# Altium schematic sheet SENSOR_BANK.SchDoc
size A4; SheetNumber: 5; SheetTotal: 10
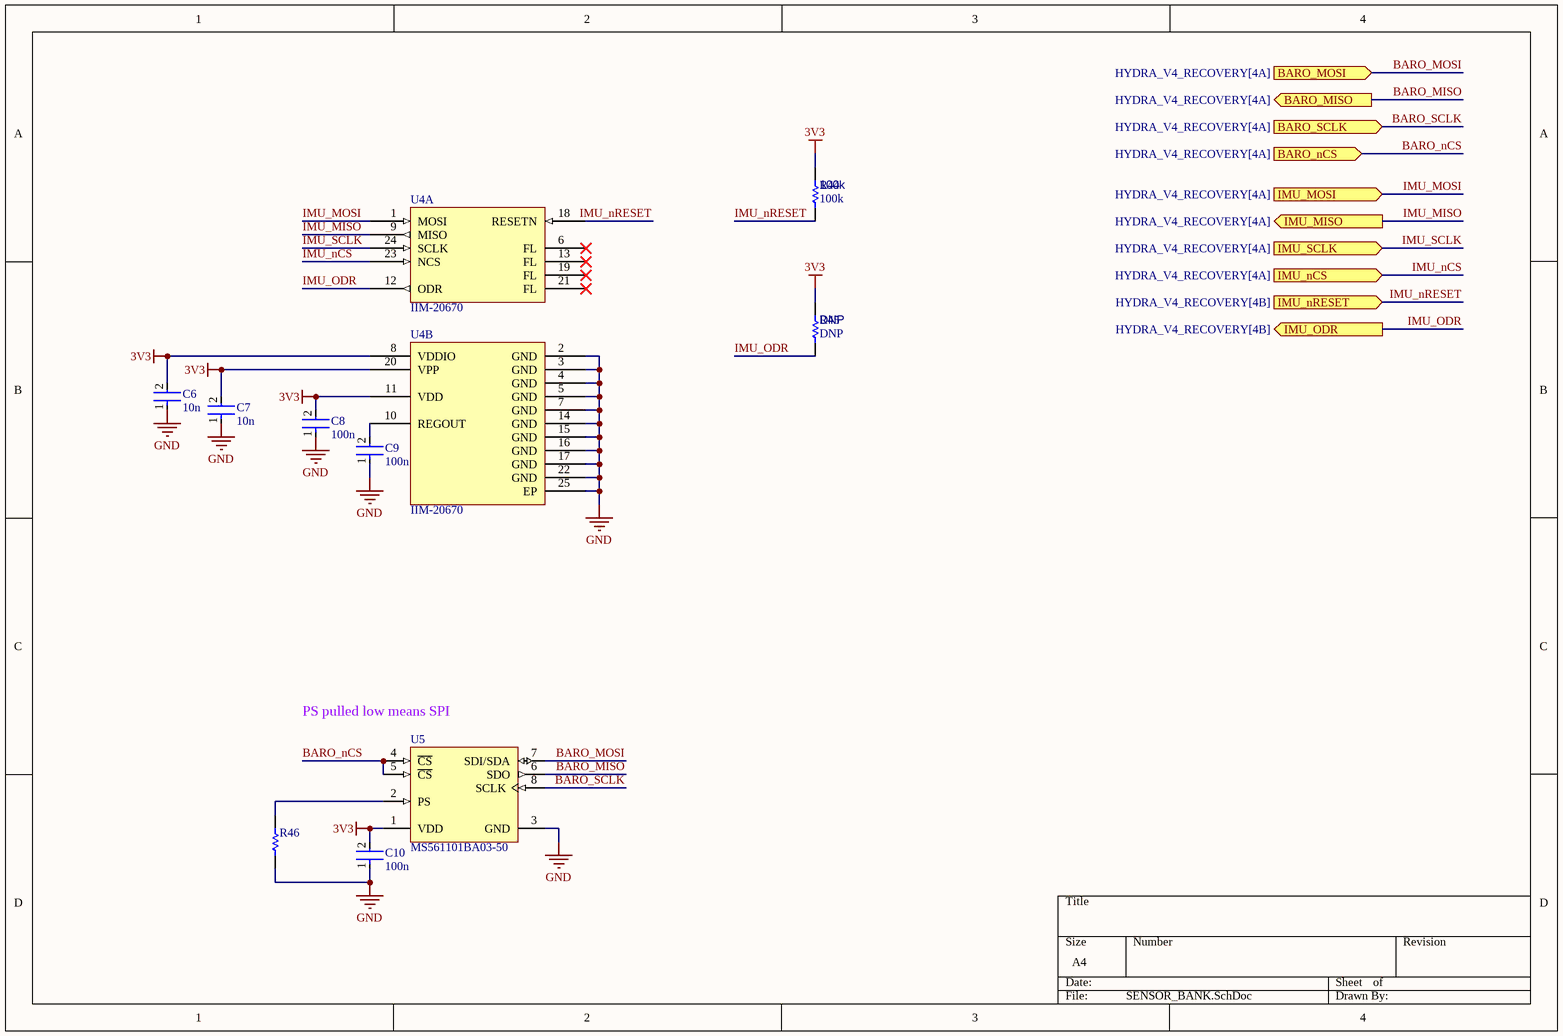
[diagram p0: SENSOR_BANK.SchDoc]

## Parts
C6  10n  [FP-0402-L_1_0_0_05-W_0_5-IPC_A]
C7  10n  [FP-0402-L_1_0_0_05-W_0_5-IPC_A]
C8  100n  [FP-0402-L_1_0_0_05-W_0_5-IPC_A]
C9  100n  [FP-0402-L_1_0_0_05-W_0_5-IPC_A]
C10  100n  [FP-0402-L_1_0_0_05-W_0_5-IPC_A]
R44  100k  [R0603B]
R45  DNP  [R0603B]
R46  0402 JUMPER  [RESC1005X40X25ML05T05]  (value not drawn)
U4  IIM-20670  [PQFN50P450X450X115_HS-25N]  (parts A,B of 2)
U5  MS561101BA03-50  [MSI-MS561101BA03-50-8_V]

## Ports
BARO_MISO (out, see HYDRA_V4_RECOVERY[4A]), BARO_MOSI (in, see HYDRA_V4_RECOVERY[4A]), BARO_nCS (in, see HYDRA_V4_RECOVERY[4A]), BARO_SCLK (in, see HYDRA_V4_RECOVERY[4A]), IMU_MISO (out, see HYDRA_V4_RECOVERY[4A]), IMU_MOSI (in, see HYDRA_V4_RECOVERY[4A]), IMU_nCS (in, see HYDRA_V4_RECOVERY[4A]), IMU_nRESET (in, see HYDRA_V4_RECOVERY[4B]), IMU_ODR (out, see HYDRA_V4_RECOVERY[4B]), IMU_SCLK (in, see HYDRA_V4_RECOVERY[4A])

## Nets
3V3: C6.2 C7.2 C8.2 C10.2 R44.2 R45.1 U4.8(VDDIO) U4.11(VDD) U4.20(VPP) U5.1(VDD)
GND: C6.1 C7.1 C8.1 C9.1 C10.1 R46.1 U4.2(GND) U4.3(GND) U4.4(GND) U4.5(GND) U4.7(GND) U4.14(GND) U4.15(GND) U4.16(GND) U4.17(GND) U4.22(GND) U4.25(EP) U5.3(GND)
BARO_MISO: U5.6(SDO) ; port BARO_MISO
BARO_MOSI: U5.7(SDI/SDA) ; port BARO_MOSI
BARO_nCS: U5.4(~{CS}) U5.5(~{CS}) ; port BARO_nCS
BARO_SCLK: U5.8(SCLK) ; port BARO_SCLK
IMU_MISO: U4.9(MISO) ; port IMU_MISO
IMU_MOSI: U4.1(MOSI) ; port IMU_MOSI
IMU_nCS: U4.23(NCS) ; port IMU_nCS
IMU_nRESET: R44.1 U4.18(RESETN) ; port IMU_nRESET
IMU_ODR: R45.2 U4.12(ODR) ; port IMU_ODR
IMU_SCLK: U4.24(SCLK) ; port IMU_SCLK
NetC9_2: C9.2 U4.10(REGOUT)
NetR46_2: R46.2 U5.2(PS)

Not connected (* = marked no-connect by the designer): U4 6(FL)* 13(FL)* 19(FL)* 21(FL)*

## Notes on the sheet
- (near U5) PS pulled low means SPI

## Library data of the parts
C6-C10 = CMP-001-00058-1: LARGE PADS, 0402 CAP, CHANGE COMMENT TO MATCH REAL P/N; Capacitor Type: Ceramic; Min Operating Temperature: -55°C; Mounting Technology: Surface Mount; Pins: 2; Case/Package: 0402; RoHS Compliant: Yes; Max Operating Temperature: 85°C
  C6 C7: Value: 10n
  C8-C10: Value: 100n
R44 R45 = CMP-009-00002-14: Resistor
  R44: Value: 100k
  R45: Value: DNP
R46 = CMP-009-00118-2: READ THE NAME; Pins: 2; Component Type: Standard; Design Item ID: CMP-009-00206-2; Source: 0402jump.SchLib; Value: 0402 JUMPER
U4 = CMP-010-00029-4: 6-axis IMU with extended temperature range and high VRE performance
U5 = CMP-2000-05251-1: Barometric Pressure Sensor, with Stainless Steel Cap, 1.8 to 3.6 V, -45 to 85 degC, 8-Pin QFN, RoHS, Tape and Reel; Manufacturer: Measurement Specialties; Operating Pressure Max: 1200mbar; Supply Current: 12.5µA; Supply Voltage Max: 3.6V; Supply Voltage Min: 1.8V; No. of Pins: 8; Connection Size: 0.5mm; SVHC: NoSVHC(20-Jun-2013); Operating Pressure Min: 10mbar; Manufacturer URL: http://www.meas-spec.com/; Operating Temperature Min: -40degC; Pressure Type: Barometric; Package Reference: MS561101BA03-50-8; Datasheet URL: http://www.te.com/commerce/DocumentDelivery/DDEController?Action=srchrtrv&DocNm=MS5611-01BA03&DocType=Data+Sheet&DocLang=English&DocFormat=pdf&PartCntxt=CAT-BLPS0036; Package Description: 8-Pin Surface Mount Device, Body 5 x 3 mm, Pitch 1.25 mm; Sensor Case Style: QFN; Datasheet Version: Sep-15; Operating Temperature Max: 85degC